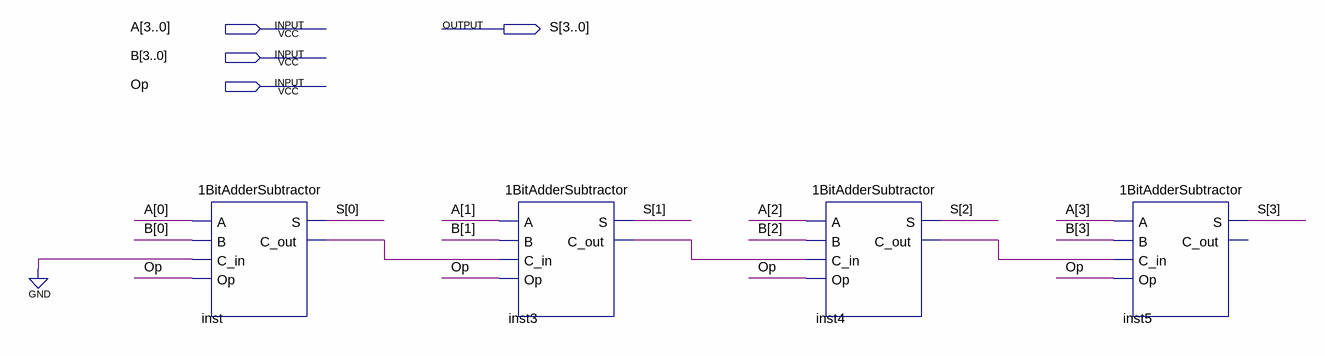
[diagram p0: schematic sheet]
// Quartus schematic AdderSubtractor.bdf as structural Verilog: 4 symbols, 4 pins
module AdderSubtractor (
  input  [3:0] A,
  input  [3:0] B,
  input  Op,
  output [3:0] S
);

  wire inst3_c_out, inst4_c_out, inst_c_out;

  \1BitAdderSubtractor  inst (.A(A[0]), .B(B[0]), .C_in(1'b0), .Op(Op), .S(S[0]), .C_out(inst_c_out));
  \1BitAdderSubtractor  inst3 (.A(A[1]), .B(B[1]), .C_in(inst_c_out), .Op(Op), .S(S[1]), .C_out(inst3_c_out));
  \1BitAdderSubtractor  inst4 (.A(A[2]), .B(B[2]), .C_in(inst3_c_out), .Op(Op), .S(S[2]), .C_out(inst4_c_out));
  \1BitAdderSubtractor  inst5 (.A(A[3]), .B(B[3]), .C_in(inst4_c_out), .Op(Op), .S(S[3]));  // open: C_out
endmodule
